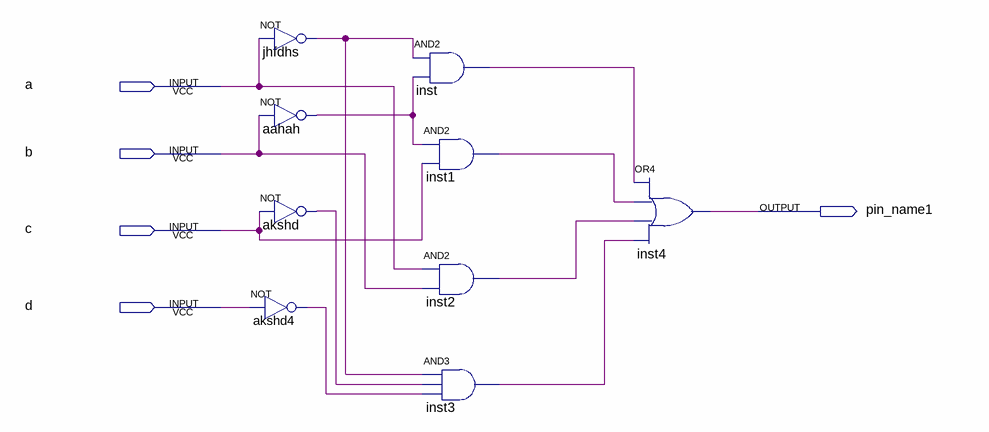
[diagram p0: schematic sheet]
// Quartus schematic decod1-4.bdf as structural Verilog: 9 symbols, 5 pins
module \decod1-4  (
  input  a,
  input  b,
  input  c,
  input  d,
  output pin_name1
);

  wire aahah_out, akshd4_out, akshd_out, inst1_out, inst2_out, inst3_out, inst_out, jhfdhs_out;

  not jhfdhs (jhfdhs_out, a);
  not aahah (aahah_out, b);
  not akshd (akshd_out, c);
  not akshd4 (akshd4_out, d);
  and inst (inst_out, jhfdhs_out, aahah_out);
  and inst1 (inst1_out, aahah_out, c);
  and inst2 (inst2_out, a, b);
  and inst3 (inst3_out, jhfdhs_out, akshd_out, akshd4_out);
  or inst4 (pin_name1, inst_out, inst1_out, inst2_out, inst3_out);
endmodule
